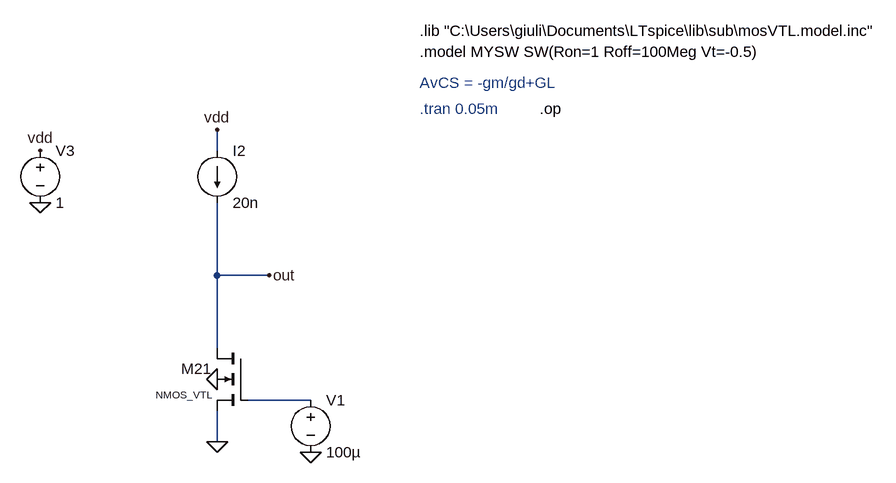
[diagram p0: schematic AMP - 1.asc]
AMP - 1.asc, the LTspice schematic file:
Version 4
SHEET 1 2012 680
WIRE -2000 -256 -2000 -288
WIRE -2000 -64 -2000 -176
WIRE -1920 -64 -2000 -64
WIRE -2000 48 -2000 -64
WIRE -1856 128 -1952 128
WIRE -2000 192 -2000 144
FLAG -2000 192 0
FLAG -2000 96 0
FLAG -2272 -176 0
FLAG -2272 -256 vdd
FLAG -2000 -288 vdd
FLAG -1920 -64 out
FLAG -1856 208 0
SYMBOL nmos4 -1952 48 M0
WINDOW 3 56 72 Left 1
SYMATTR Value NMOS_VTL
SYMATTR InstName M21
SYMATTR Value2 l=50n w=70n
SYMBOL current -2000 -256 R0
WINDOW 123 0 0 Left 0
WINDOW 39 0 0 Left 0
SYMATTR InstName I2
SYMATTR Value 20n
SYMBOL voltage -2272 -272 R0
SYMATTR InstName V3
SYMATTR Value 1
SYMBOL voltage -1856 112 R0
SYMATTR InstName V1
SYMATTR Value 100µ
TEXT -1688 -440 Left 2 !.lib "C:\\Users\\giuli\\Documents\\LTspice\\lib\\sub\\mosVTL.model.inc"
TEXT -1688 -408 Left 2 !.model MYSW SW(Ron=1 Roff=100Meg Vt=-0.5)
TEXT -1688 -320 Left 2 ;.tran 0.05m
TEXT -1504 -320 Left 2 !.op
TEXT -1688 -360 Left 2 ;AvCS = -gm/gd+GL

The netlist it stands for:
* AMP - 1.asc
M21 out N001 0 0 NMOS_VTL l=50n w=70n
I2 vdd out 20n
V3 vdd 0 1
V1 N001 0 100µ
.model NMOS NMOS
.model PMOS PMOS
.lib standard.mos
.lib "C:\Users\giuli\Documents\LTspice\lib\sub\mosVTL.model.inc"
.model MYSW SW(Ron=1 Roff=100Meg Vt=-0.5)
* .tran 0.05m
.op
* AvCS = -gm/gd+GL
.backanno
.end